# EAGLE schematic matrsas_el (EAGLE 7.0.0)
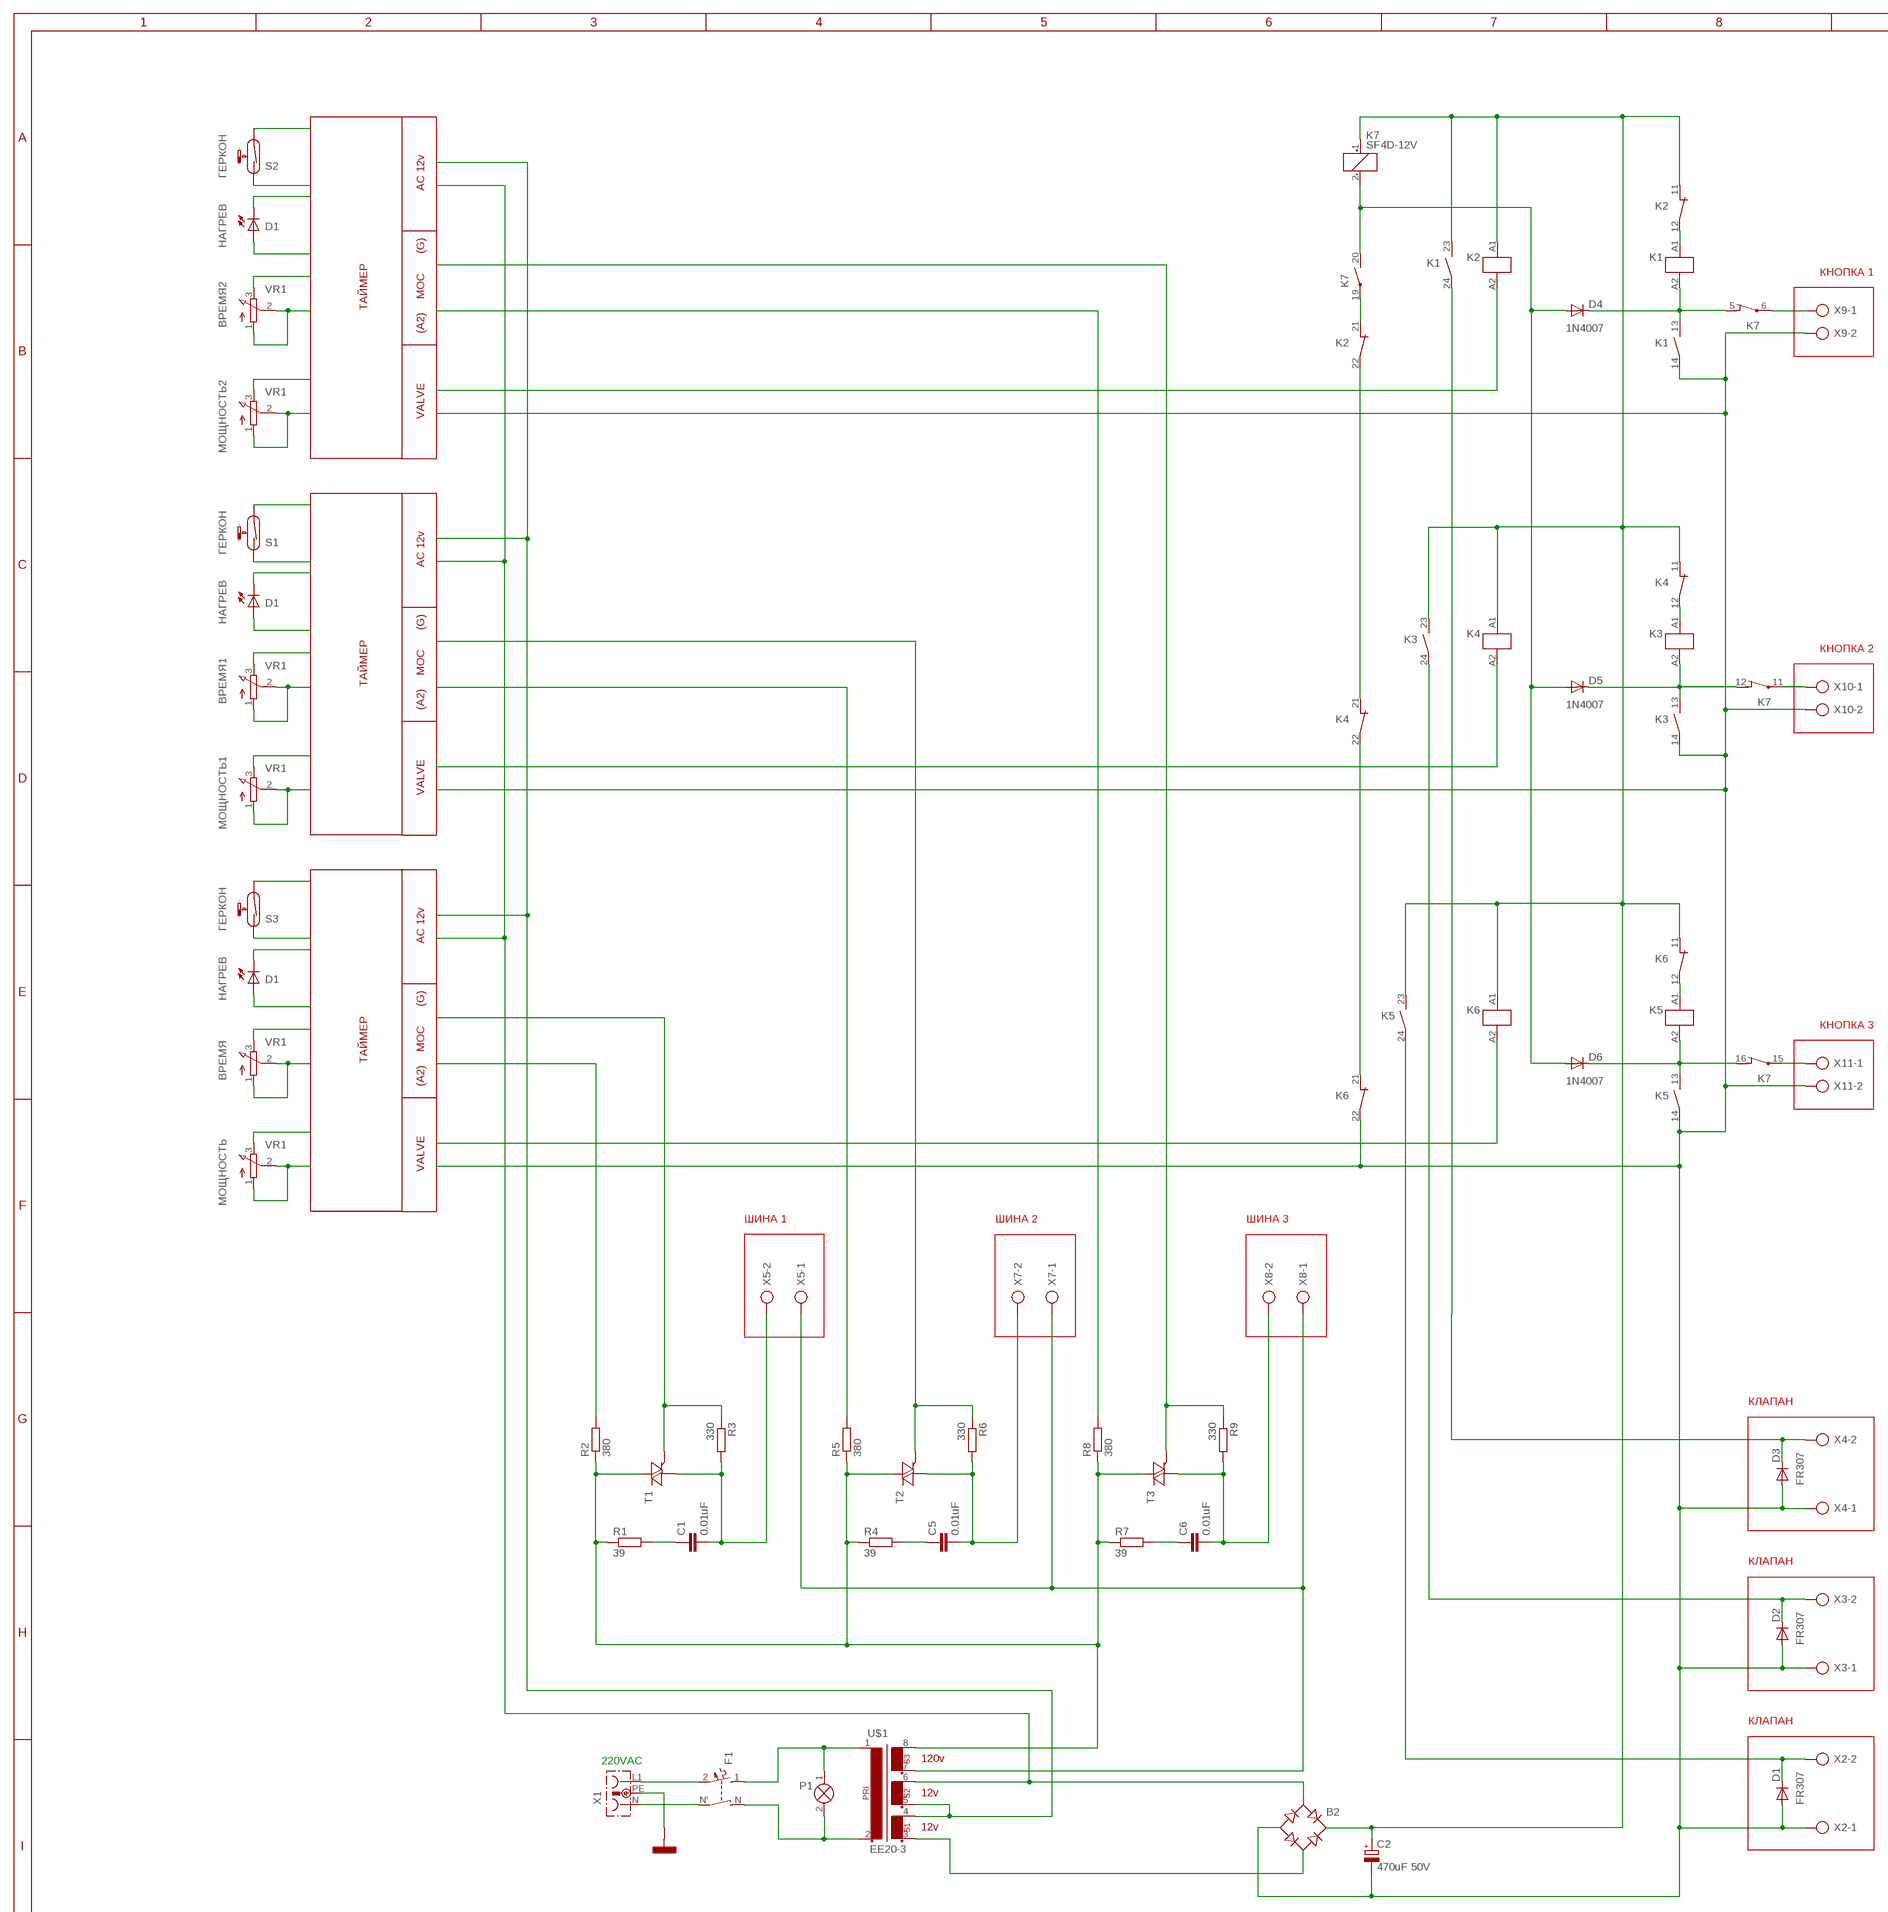
[diagram p0: schematic, sheet 1, part 1 of 2]
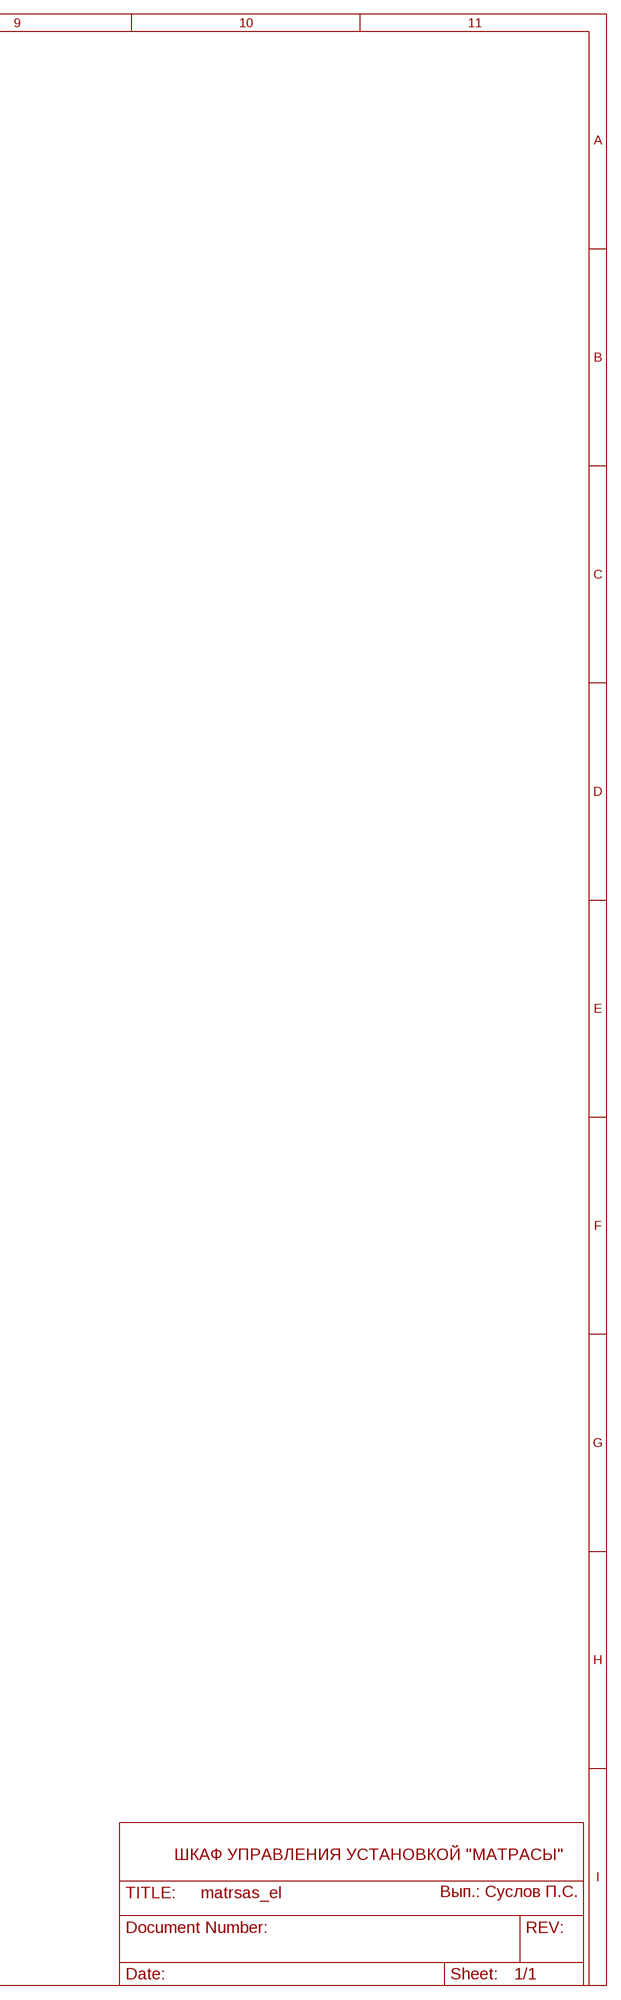
[diagram p1: schematic, sheet 1, part 2 of 2]

## Parts
B2  B-DIL  [B-DIL]
C1  0.01uF  C-EU025-030X050  [C025-030X050]
C2  470uF 50V  CPOL-EUE5-10.5  [E5-10,5]
C5  0.01uF  C-EU025-030X050  [C025-030X050]
C6  0.01uF  C-EU025-030X050  [C025-030X050]
D1  FR307  1N5624  [DO201-15]
D2  FR307  1N5624  [DO201-15]
D3  FR307  1N5624  [DO201-15]
D4  1N4007  1N5624  [DO201-15]
D5  1N4007  1N5624  [DO201-15]
D6  1N4007  1N5624  [DO201-15]
F1  LEITUNGSSCHUTZSCHALTER_2-POL  [LEITUNGSSCHUTZSCHALTER_2-POL]
K1  HILFSSCHUETZ_13-14_23-24  [HILFSSCHUETZ_13-14_23-24]
K2  HILFSSCHUETZ_11-12_21-22  [HILFSSCHUETZ_11-12_21-22]
K3  HILFSSCHUETZ_13-14_23-24  [HILFSSCHUETZ_13-14_23-24]
K4  HILFSSCHUETZ_11-12_21-22  [HILFSSCHUETZ_11-12_21-22]
K5  HILFSSCHUETZ_13-14_23-24  [HILFSSCHUETZ_13-14_23-24]
K6  HILFSSCHUETZ_11-12_21-22  [HILFSSCHUETZ_11-12_21-22]
K7  SF4D-12V  [SF4D]
P1  SIGNALLAMPE  [LAMPE]
R1  39  R-EU_0207/5V  [0207/5V]
R2  380  R-EU_0207/5V  [0207/5V]
R3  330  R-EU_0207/5V  [0207/5V]
R4  39  R-EU_0207/5V  [0207/5V]
R5  380  R-EU_0207/5V  [0207/5V]
R6  330  R-EU_0207/5V  [0207/5V]
R7  39  R-EU_0207/5V  [0207/5V]
R8  380  R-EU_0207/5V  [0207/5V]
R9  330  R-EU_0207/5V  [0207/5V]
S1  ГЕРКОН  REED-SWITCH-CT10-1530-G1  [CT10-G1]
S2  ГЕРКОН  REED-SWITCH-CT10-1530-G1  [CT10-G1]
S3  ГЕРКОН  REED-SWITCH-CT10-1530-G1  [CT10-G1]
T1  BTA26-V  [TOP3S-1]
T2  BTA26-V  [TOP3S-1]
T3  BTA26-V  [TOP3S-1]
U$1  EE20-3  [EI54-18,8_16VA]
X1  STECKDOSE  [STECKDOSE]
X2  AK500/2  [AK500/2]
X3  AK500/2  [AK500/2]
X4  AK500/2  [AK500/2]
X5  AK500/2  [AK500/2]
X6  MASSE_ALLGEMEIN  [MASSE_ALLGEMEIN]
X7  AK500/2  [AK500/2]
X8  AK500/2  [AK500/2]
X9  AK500/2  [AK500/2]
X10  AK500/2  [AK500/2]
X11  AK500/2  [AK500/2]
ВРЕМЯ  3RP/1610N  [3RP/1610N]
ВРЕМЯ1  3RP/1610N  [3RP/1610N]
ВРЕМЯ2  3RP/1610N  [3RP/1610N]
ГОТОВ  НАГРЕВ  LED5MM  [LED5MM]
ГОТОВ1  НАГРЕВ  LED5MM  [LED5MM]
ГОТОВ2  НАГРЕВ  LED5MM  [LED5MM]
МОЩНОСТЬ  3RP/1610N  [3RP/1610N]
МОЩНОСТЬ1  3RP/1610N  [3RP/1610N]
МОЩНОСТЬ2  3RP/1610N  [3RP/1610N]

## Nets
+24V: B2.+ C2.+ K1.23 K2.11 K2.A1 K3.23 K4.11 K4.A1 K5.23 K6.11 K6.A1 K7.1(1:+)
AC12V1: B2.AC1 U$1.6
AC12V2: U$1.4 U$1.5
G24V: B2.- C2.- D1.A D2.A D3.A K1.14 K3.14 K5.14 K6.22 X2.1 X3.1 X4.1 X9.2 X10.2 X11.2
MOC1: R6.1 T2.G
MOC2: R5.2
MOC3: R9.1 T3.G
MOC4: R3.1 T1.G
MOC5: R8.2
MOC6: R2.2
N$1: F1.2 X1.L1
N$2: F1.N'(N) X1.N
N$3: F1.1 P1.1(X1) U$1.1
N$4: F1.N P1.2(X2) U$1.2
N$5: K1.A1(_:A1) K2.12
N$6: D2.C K3.24 X3.2
N$7: B2.AC2 U$1.3
N$8: C1.2 R3.2 T1.A1 X5.2
N$9: C1.1 R1.2
N$11: K1.24
N$12: D4.A D5.A D6.A K7.2(1:-) K7.20(9:S)
N$13: D3.C X4.2
N$14: X1.PE X6.1(0V)
N$15: D4.C K1.13 K1.A2(_:A2) K7.5(2:O)
N$16: K4.22 K6.21
N$17: D1.C K5.24 X2.2
N$19: ГОТОВ.A
N$20: K3.A1(_:A1) K4.12
N$21: ГОТОВ.K(C)
N$22: ВРЕМЯ.3(E)
N$23: ВРЕМЯ.1(A) ВРЕМЯ.2(S)
N$24: C5.2 R6.2 T2.A1 X7.2
N$25: C5.1 R4.2
N$26: D5.C K3.13 K3.A2(_:A2) K7.12(5:O)
N$27: K2.22 K4.21
N$28: R1.1 R2.1 R4.1 R5.1 R7.1 R8.1 T1.A2 T2.A2 T3.A2 U$1.8
N$29: C6.2 R9.2 T3.A1 X8.2
N$30: C6.1 R7.2
N$31: K2.21 K7.19(9:P)
N$32: K5.A1(_:A1) K6.12
N$33: U$1.7 X5.1 X7.1 X8.1
N$34: S3.1
N$35: S3.2
N$36: МОЩНОСТЬ.3(E)
N$37: МОЩНОСТЬ.1(A) МОЩНОСТЬ.2(S)
N$38: D6.C K5.13 K5.A2(_:A2) K7.16(7:O)
N$39: K7.6(2:P) X9.1
N$40: K6.A2
N$41: K7.11(5:P) X10.1
N$42: ГОТОВ1.A
N$43: ГОТОВ1.K(C)
N$44: ВРЕМЯ1.3(E)
N$45: ВРЕМЯ1.1(A) ВРЕМЯ1.2(S)
N$46: S1.1
N$47: S1.2
N$48: K4.A2
N$50: МОЩНОСТЬ1.3(E)
N$51: МОЩНОСТЬ1.1(A) МОЩНОСТЬ1.2(S)
N$53: K7.15(7:P) X11.1
N$54: ГОТОВ2.A
N$55: ГОТОВ2.K(C)
N$56: ВРЕМЯ2.3(E)
N$57: ВРЕМЯ2.1(A) ВРЕМЯ2.2(S)
N$58: S2.1
N$59: S2.2
N$60: K2.A2
N$62: МОЩНОСТЬ2.3(E)
N$63: МОЩНОСТЬ2.1(A) МОЩНОСТЬ2.2(S)
Unconnected: K7.7(3:P) K7.8(3:S) K7.9(4:S) K7.10(4:P) K7.13(6:S) K7.14(6:P) K7.17(8:O) K7.18(8:P)

## Notes on the sheet
- AC 12v
- D1
- (G)
- КНОПКА 1
- VR1
- MOC
- ТАЙМЕР
- (A2)
- VR1
- VALVE
- AC 12v
- D1
- (G)
- КНОПКА 2
- VR1
- MOC
- ТАЙМЕР
- (A2)
- VR1
- VALVE
- AC 12v
- D1
- (G)
- КНОПКА 3
- VR1
- MOC
- ТАЙМЕР
- (A2)
- VR1
- VALVE
- ШИНА 1 | ШИНА 2 | ШИНА 3
- КЛАПАН
- КЛАПАН
- КЛАПАН
- 220VAC | 120v
- 12v
- 12v | ШКАФ УПРАВЛЕНИЯ УСТАНОВКОЙ "МАТРАСЫ"
- Вып.: Суслов П.С.

## Library data of the parts
B2 = rectifier:B-DIL: RECTIFIER
C1 C5 C6 = rcl:C-EU: CAPACITOR, European symbol
C2 = rcl:CPOL-EU: POLARIZED CAPACITOR, European symbol
D1-D6 = diode:1N5624: DIODE controlled avalanche rectifier
F1 = e-sicherungen:LEITUNGSSCHUTZSCHALTER_2-POL: Leitungsschutzschalter, 2-pol.
K1 K3 K5 = e-schuetze-relais:HILFSSCHUETZ_13-14_23-24: Hilfsschütz mit 2 Schließern
K2 K4 K6 = e-schuetze-relais:HILFSSCHUETZ_11-12_21-22: Hilfsschütz mit 2 Öffnern
K7 = relay:SF4D-*: POLARISED, MONOSTABLE RELAY WITH FORCIBLY GUIDED DOUBLE CONTACTS NAiS Source: http://www.mew-europe.com/.. en_ds_61407_0002.pdf; OC_FARNELL: unknown; OC_NEWARK: unknown
P1 = e-lampen-signalisation:SIGNALLAMPE: Lampe
R1-R9 = rcl:R-EU_: RESISTOR, European symbol
S1-S3 = switch-reed:REED-SWITCH-: Reed Sensor; MF: COTO TECHNOLOGY; MPN: CT10-1530-G1; OC_FARNELL: 1081696
T1-T3 = triac:BTA26: 25A TRIAC Source: http://www.st.com/stonline/products/literature/ds/7470.pdf
U$1 = trafo:EE20-3
X1 = e-steckverbinder:STECKDOSE: Steckdose mit Schutzleiter
X2-X5 X7-X11 = con-ptr500:AK500/2: CONNECTOR; OC_FARNELL: unknown; OC_NEWARK: unknown
X6 = e-klemmen:MASSE_ALLGEMEIN: Masse allgemein
ВРЕМЯ ВРЕМЯ1 ВРЕМЯ2 МОЩНОСТЬ МОЩНОСТЬ1 МОЩНОСТЬ2 = pot:3RP/1610N: 16mm Potentiometer one level Source: http://www.alphapotentiometers.net/html/16mm_pot_2.html
ГОТОВ ГОТОВ1 ГОТОВ2 = led:LED: LED OSRAM: - CHIPLED LG R971, LG N971, LY N971, LG Q971, LY Q971, LO R971, LY R971 LH N974, LH R974 LS Q976, LO Q976, LY Q976 LO Q996 - Hyper CHIPLED LW Q18S LB Q993, LB Q99A, LB R99A - SideLED LS A670, LO A670, LY A670, LG A670, LP A670 LB A673, LV A673, LT A673, LW A673 LH A674 LY A675 LS A676, LA A676, LO A676, LY A676, LW A676 LS A679, LY A679, LG A679 - Hyper Micro SIDELED® LS Y876, LA Y876, LO Y876, LY Y876 LT Y87S - SmartLED LW L88C, LW L88S LB L89C, LB L89S, LG L890 LS L89K, LO L89K, LY L89K LS L896, LA L896, LO L896, LY L896 - TOPLED LS T670, LO T670, LY T670, LG T670, LP T670 LSG T670, LSP T670, LSY T670, LOP T670, LYG T670 LG T671, LOG T671, LSG T671 LB T673, LV T673, LT T673, LW T673 LH T674 LS T676, LA T676, LO T676, LY T676, LB T676, LH T676, LSB T676, LW T676 LB T67C, LV T67C, LT T67C, LS T67K, LO T67K, LY T67K, LW E67C LS E67B, LA E67B, LO E67B, LY E67B, LB E67C, LV E67C, LT E67C LW T67C LS T679, LY T679, LG T679 LS T770, LO T770, LY T770, LG T770, LP T770 LB T773, LV T773, LT T773, LW T773 LH T774 LS E675, LA E675, LY E675, LS T675 LS T776, LA T776, LO T776, LY T776, LB T776 LHGB T686 LT T68C, LB T68C - Hyper Mini TOPLED® LB M676 - Mini TOPLED Santana® LG M470 LS M47K, LO M47K, LY M47K Source: http://www.osram.convergy.de LUXEON: - LUMILED® LXK2-PW12-R00, LXK2-PW12-S00, LXK2-PW14-U00, LXK2-PW14-V00 LXK2-PM12-R00, LXK2-PM12-S00, LXK2-PM14-U00 LXK2-PE12-Q00, LXK2-PE12-R00, LXK2-PE12-S00, LXK2-PE14-T00, LXK2-PE14-U00 LXK2-PB12-K00, LXK2-PB12-L00, LXK2-PB12-M00, LXK2-PB14-N00, LXK2-PB14-P00, LXK2-PB14-Q00 LXK2-PR12-L00, LXK2-PR12-M00, LXK2-PR14-Q00, LXK2-PR14-R00 LXK2-PD12-Q00, LXK2-PD12-R00, LXK2-PD12-S00 LXK2-PH12-R00, LXK2-PH12-S00 LXK2-PL12-P00, LXK2-PL12-Q00, LXK2-PL12-R00 Source: www.luxeon.com KINGBRIGHT: KA-3528ASYC Source: www.kingbright.com